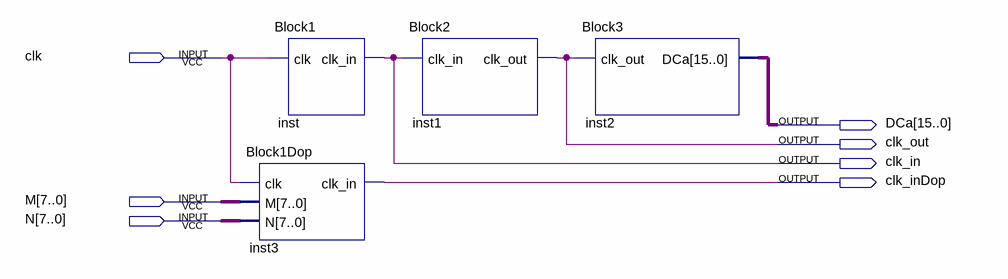
[diagram p0: schematic sheet]
// Quartus schematic Lab2WithBlocks.bdf as structural Verilog: 4 symbols, 7 pins
module Lab2WithBlocks (
  input  clk,
  input  [7:0] M,
  input  [7:0] N,
  output [15:0] DCa,
  output clk_out,
  output clk_in,
  output clk_inDop
);

  Block1Dop inst3 (.clk(clk), .M(M), .N(N), .clk_in(clk_inDop));
  Block1 inst (.clk(clk), .clk_in(clk_in));
  Block2 inst1 (.clk_in(clk_in), .clk_out(clk_out));
  Block3 inst2 (.clk_out(clk_out), .DCa(DCa));
endmodule
